# Altium project UZ_A_DAC.PrjPcb (part 1 of 3)
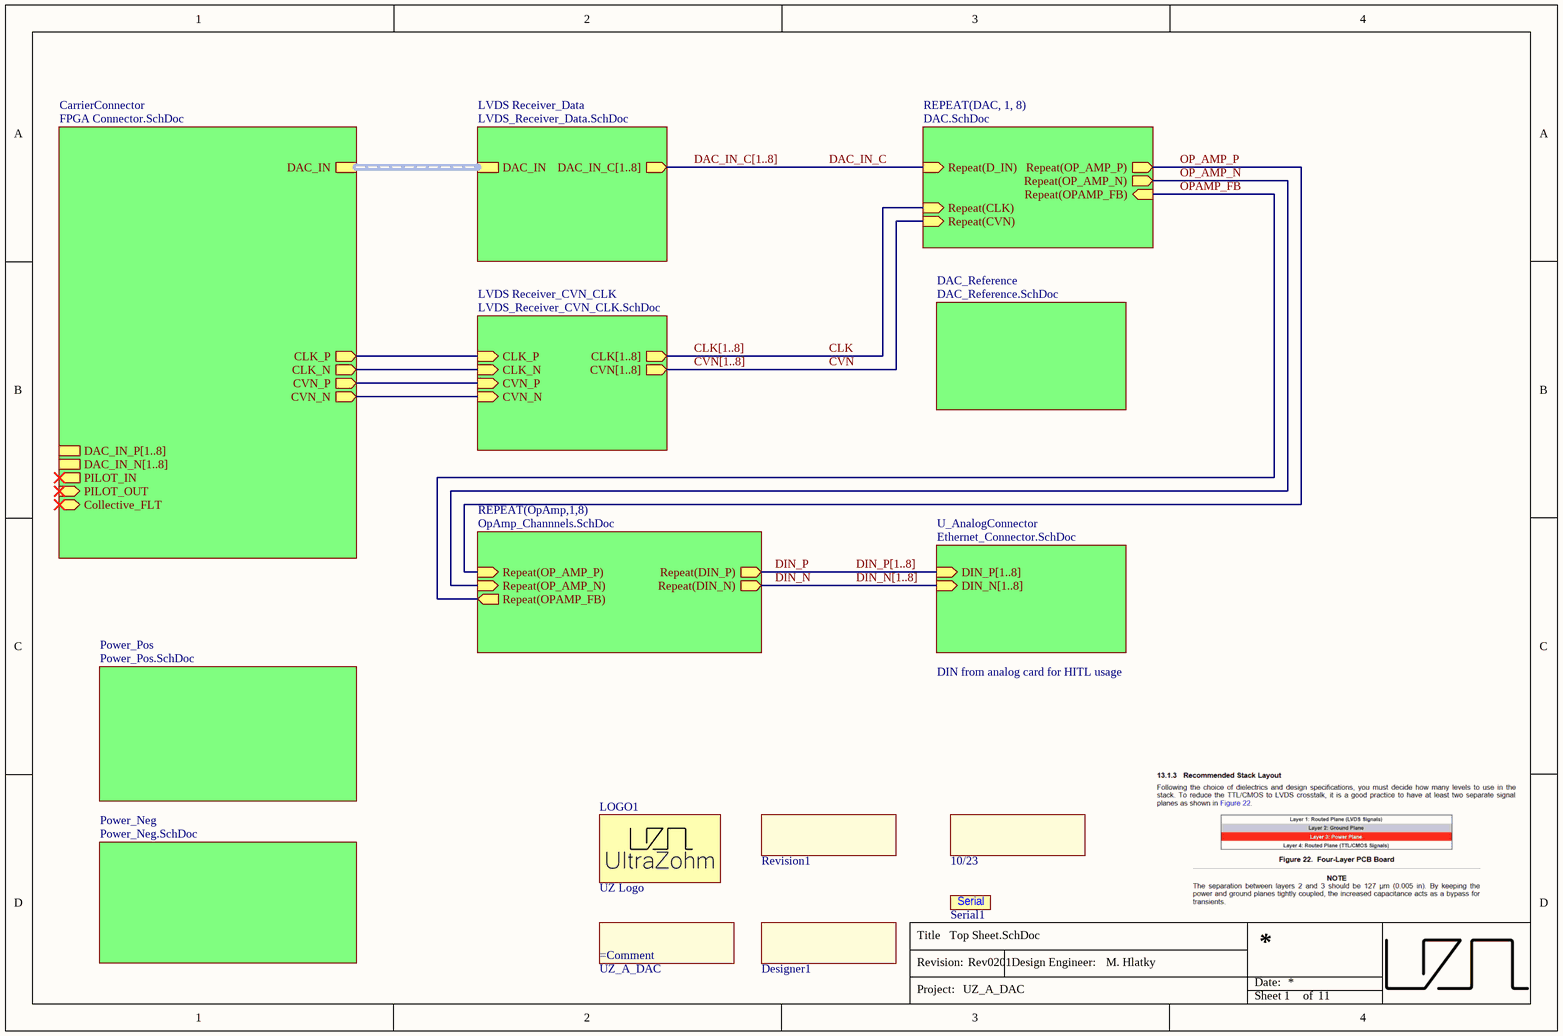
[diagram p0: Top Sheet.SchDoc]
ProjectRevision: Rev0201; ProjectName: UZ_A_DAC; ProjectAuthor: M. Hlatky; AuthorParam: M. Hlatky; Author: M. Hlatky
10 sheets, 409 parts. Net scope: hierarchical (ports join the sheet entries above them; power ports are global).
Board file: UZ_A_DAC.PcbDoc
Sheets:
  Top Sheet.SchDoc
    Power_Pos = Power_Pos.SchDoc
    DAC1 = DAC.SchDoc
    DAC2 = DAC.SchDoc
    DAC3 = DAC.SchDoc
    DAC4 = DAC.SchDoc
    DAC5 = DAC.SchDoc
    DAC6 = DAC.SchDoc
    DAC7 = DAC.SchDoc
    DAC8 = DAC.SchDoc
    OpAmp1 = OpAmp_Channnels.SchDoc
    OpAmp2 = OpAmp_Channnels.SchDoc
    OpAmp3 = OpAmp_Channnels.SchDoc
    OpAmp4 = OpAmp_Channnels.SchDoc
    OpAmp5 = OpAmp_Channnels.SchDoc
    OpAmp6 = OpAmp_Channnels.SchDoc
    OpAmp7 = OpAmp_Channnels.SchDoc
    OpAmp8 = OpAmp_Channnels.SchDoc
    Power_Neg = Power_Neg.SchDoc
    DAC_Reference = DAC_Reference.SchDoc
    U_AnalogConnector = Ethernet_Connector.SchDoc
    CarrierConnector = FPGA Connector.SchDoc
    LVDS Receiver_Data = LVDS_Receiver_Data.SchDoc
    LVDS Receiver_CVN_CLK = LVDS_Receiver_CVN_CLK.SchDoc

## Sheet Top Sheet.SchDoc
size A4; DocumentNumber: 1; SheetNumber: 1; SheetTotal: 11

### Parts
10/23  (no value)  [COMMENT]  (no BOM)
Designer1  (no value)  [Designator:comment]  (no BOM)
LOGO1  UZ Logo  [UZ_Logo_small]  (no BOM)
Revision1  (no value)  [Designator:comment]  (no BOM)
Serial1  Serial #  [SERIAL]  (value not drawn)
UZ_A_DAC  (no value)  [COMMENT]  (no BOM)

### Sub-sheets
CarrierConnector = FPGA Connector.SchDoc: CLK_P (out), CLK_N (out), CVN_P (out), CVN_N (out), PILOT_IN (out), PILOT_OUT (in), Collective_FLT (bidir), DAC_IN, DAC_IN_P[1..8], DAC_IN_N[1..8]
DAC_Reference = DAC_Reference.SchDoc: no entries
LVDS Receiver_CVN_CLK = LVDS_Receiver_CVN_CLK.SchDoc: CLK_P (in), CLK_N (in), CVN_P (in), CVN_N (in), CLK[1..8] (out), CVN[1..8] (out)
LVDS Receiver_Data = LVDS_Receiver_Data.SchDoc: DAC_IN, DAC_IN_C[1..8] (out)
Power_Neg = Power_Neg.SchDoc: no entries
Power_Pos = Power_Pos.SchDoc: no entries
REPEAT(DAC, 1, 8) = DAC.SchDoc: Repeat(CLK) (in), Repeat(D_IN) (in), Repeat(CVN) (in), Repeat(OP_AMP_P) (out), Repeat(OP_AMP_N) (out), Repeat(OPAMP_FB) (in)
REPEAT(OpAmp,1,8) = OpAmp_Channnels.SchDoc: Repeat(DIN_P) (out), Repeat(DIN_N) (out), Repeat(OP_AMP_P) (in), Repeat(OP_AMP_N) (in), Repeat(OPAMP_FB) (out)
U_AnalogConnector = Ethernet_Connector.SchDoc: DIN_P[1..8] (in), DIN_N[1..8] (in)

### Nets
CLK: sheet REPEAT(DAC, 1, 8)/Repeat(CLK)
CLK_N: sheet CarrierConnector/CLK_N, sheet LVDS Receiver_CVN_CLK/CLK_N
CLK_P: sheet CarrierConnector/CLK_P, sheet LVDS Receiver_CVN_CLK/CLK_P
CVN: sheet REPEAT(DAC, 1, 8)/Repeat(CVN)
CVN_N: sheet CarrierConnector/CVN_N, sheet LVDS Receiver_CVN_CLK/CVN_N
CVN_P: sheet CarrierConnector/CVN_P, sheet LVDS Receiver_CVN_CLK/CVN_P
DAC_IN_C: sheet REPEAT(DAC, 1, 8)/Repeat(D_IN)
DIN_N: sheet REPEAT(OpAmp,1,8)/Repeat(DIN_N)
DIN_P: sheet REPEAT(OpAmp,1,8)/Repeat(DIN_P)
OP_AMP_N: sheet REPEAT(DAC, 1, 8)/Repeat(OP_AMP_N), sheet REPEAT(OpAmp,1,8)/Repeat(OP_AMP_N)
OP_AMP_P: sheet REPEAT(DAC, 1, 8)/Repeat(OP_AMP_P), sheet REPEAT(OpAmp,1,8)/Repeat(OP_AMP_P)
OPAMP_FB: sheet REPEAT(DAC, 1, 8)/Repeat(OPAMP_FB), sheet REPEAT(OpAmp,1,8)/Repeat(OPAMP_FB)

### Buses and harness runs
bus CLK[1..8] = sheet LVDS Receiver_CVN_CLK/CLK[1..8]
bus CVN[1..8] = sheet LVDS Receiver_CVN_CLK/CVN[1..8]
bus DAC_IN_C[1..8] = sheet LVDS Receiver_Data/DAC_IN_C[1..8]
bus DIN_N[1..8] = sheet U_AnalogConnector/DIN_N[1..8]
bus DIN_P[1..8] = sheet U_AnalogConnector/DIN_P[1..8]
harness sheet CarrierConnector/DAC_IN = sheet LVDS Receiver_Data/DAC_IN

### Notes on the sheet
- DIN from analog card for HITL usage
- Title
- Revision:
- Design Engineer:
- Date:
- Project:
- Sheet
- of
- (in symbol 6) Serial

### Library data of the parts
10/23 = 5: Create a project parameter named "FinDate" this is the value of this component. It is printed on the PCB. Once the parameter is updated (e.g. new revision) it gets updated on the PCB as well; Manufacturer: PCB Manufacturer; Manufacturer Part Number: Project End Date; Created from: T. Wendt; PartID: 5; Created On: 01.03.2021 09:01:41; Component Type: Date of Project Finalization; Last Updated: 01.03.2021 09:01:41; Type: Standard (No BOM); Value: =FinDate; Live Cycle Status: 1
Designer1 = 4: Create a project parameter named "Author" this is the value of this component. It is printed on the PCB. Once the parameter is updated (e.g. new revision) it gets updated on the PCB as well; Manufacturer: PCB Manufacturer; Manufacturer Part Number: Project Author; Value: M. Hlatky; Created from: T. Wendt; PartID: 4; Created On: 01.03.2021 08:53:41; Component Type: Project Author; Last Updated: 01.03.2021 09:20:27; Type: Standard (No BOM); Live Cycle Status: 1
LOGO1 = Logo small: Manufacturer: UltraZohm; Created from: MGremer; Created: Jan2021_Liegmann; Value: Logo; Manufacturer Part Number: Logo small; PartID: 10; Created On: 03.11.2021 09:04:23; ComponentLink1Description: https://docs.ultrazohm.com/; ComponentLink1URL: homepage; Component Type: Logo; Last Updated: 03.11.2021 09:05:50; Supplier 1: -; Supplier Part Number 1: -; Type: Logo; Live Cycle Status: 1
Revision1 = 3: Create a project parameter named "ProjectRevision" this is the value of this component. It is printed on the PCB. Once the parameter is updated (e.g. new revision) it gets updated on the PCB as well; Manufacturer: PCB Manufacturer; Value: Rev0201; Created from: T. Wendt; PartID: 3; Created On: 01.03.2021 08:50:34; Component Type: Project Revision; Last Updated: 01.03.2021 09:28:36; Manufacturer Part Number: Project Revision; Type: Standard (No BOM); Live Cycle Status: 1
Serial1 = 6: Field to put in a serial number; Manufacturer: PCB Manufacturer; Created from: T. Wendt; PartID: 6; Created On: 02.03.2021 14:31:24; Component Type: Serial Number; Last Updated: 02.03.2021 14:31:24; Manufacturer Part Number: Serial Number; Type: Standard (No BOM); Live Cycle Status: 1
UZ_A_DAC = 2: Create a project parameter named "ProjectNameCustom" this is the value of this component and it is printed on the PCB.; Manufacturer: PCB Manufacturer; Created from: T. Wendt; PartID: 2; Created On: 01.03.2021 08:43:57; Component Type: Project Name; Last Updated: 01.03.2021 09:07:27; Manufacturer Part Number: Project Name; Type: Standard (No BOM); Value: =ProjectNameCustom; Live Cycle Status: 1

## Sheet Power_Pos.SchDoc
size A4; DocumentNumber: 2; SheetNumber: 2; SheetTotal: 11
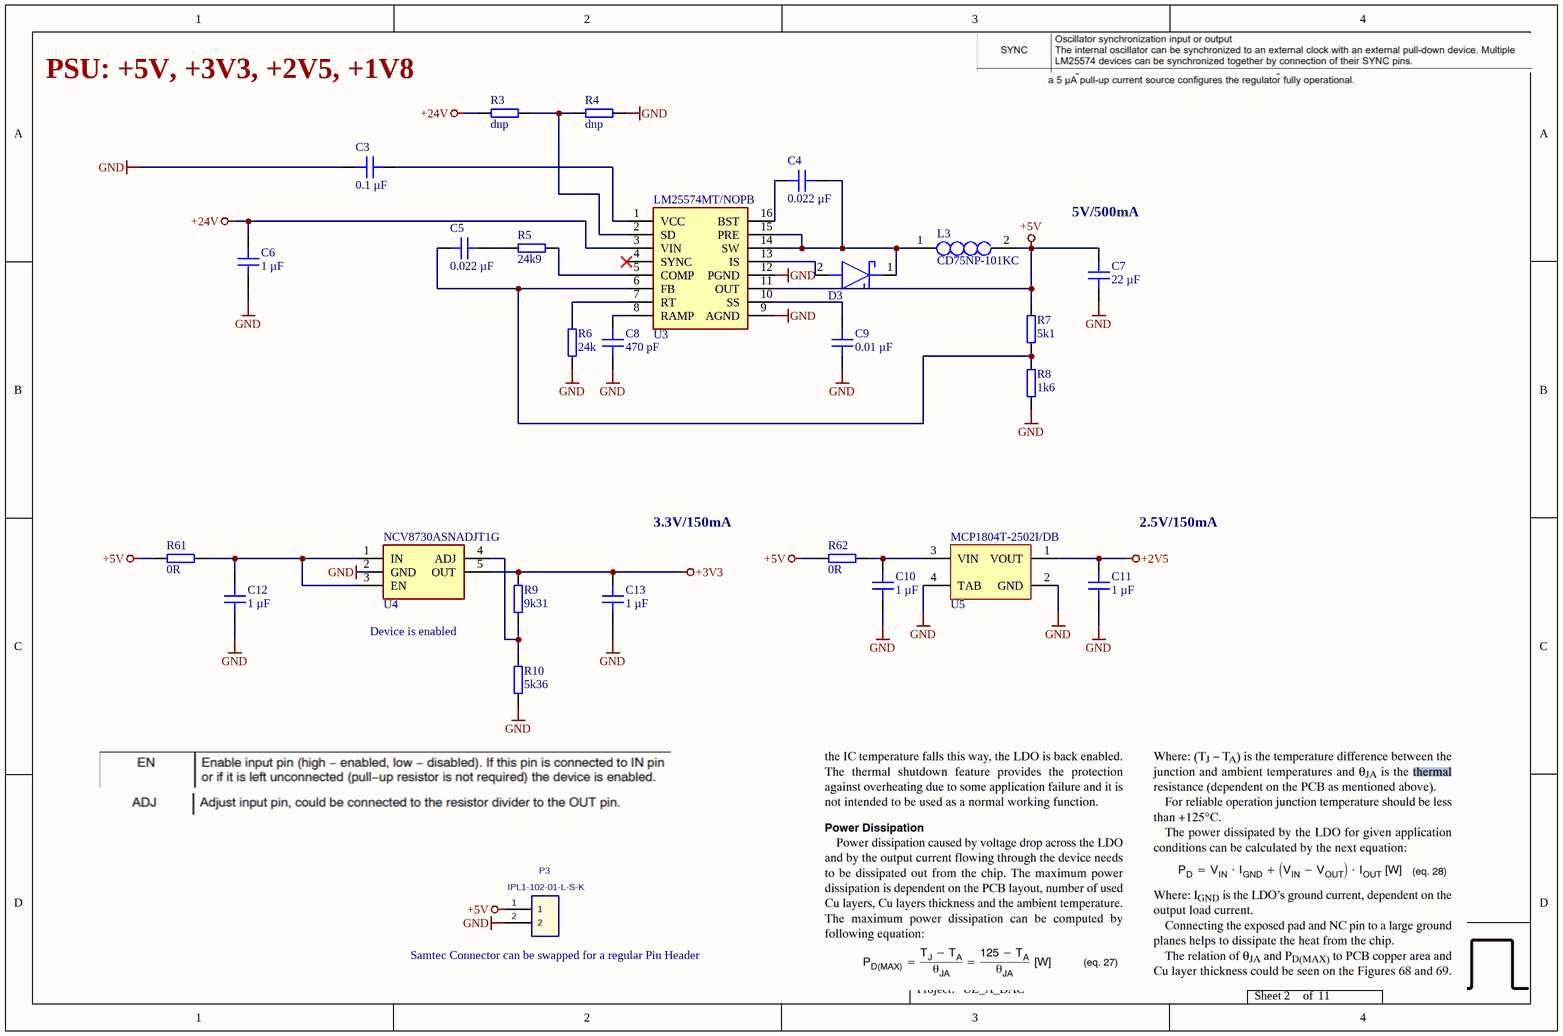
[diagram p1: Power_Pos.SchDoc]

### Parts
C3  0.1 µF  [C_0603]
C4  0.022 µF  [C_0805]
C5  0.022 µF  [C_0805]
C6  1 µF  [C_1206]
C7  22 µF  [C_0805]
C8  470 pF  [C_0805]
C9  0.01 µF  [C_0603]
C10  1 µF  [C_1206]
C11  1 µF  [C_1206]
C12  1 µF  [C_1206]
C13  1 µF  [C_1206]
D3  CDBA260-G  [DIOM5226X262N]  (value not drawn)
L3  CD75NP-101KC  [784787121]
P3  IPL1-102-01-L-S-K  [IPL1-102-01-YYY-S-K]
R3  dnp  [RES 0603_1608]
R4  dnp  [RES 0603_1608]
R5  24k9  [RES 0603_1608]
R6  24k  [RES 0603_1608]
R7  5k1  [RES 0603_1608]
R8  1k6  [RES 0603_1608]
R9  9k31  [RES 0603_1608]
R10  5k36  [RES 0603_1608]
R61  0R  [RES 0603_1608]
R62  0R  [RES 0603_1608]
U3  LM25574MT/NOPB  [SOP65P640X120-16N]
U4  NCV8730ASNADJT1G  [SOT95P275X110-5N]
U5  MCP1804T-2502I/DB  [SOT-223-DB3_N]

### Nets
+2V5: C11.2 U5.1(VOUT)
+3V3: C13.2 R9.2 U4.5(OUT)
+5V: C7.2 L3.2 P3.1 R7.2 R61.1 R62.1 U3.11(OUT)
+24V: C6.2 R3.1 U3.3(VIN)
GND: C3.2 C6.1 C7.1 C8.1 C9.1 C10.1 C11.1 C12.1 C13.1 P3.2 R4.2 R6.1 R8.1 R10.1 U3.9(AGND) U3.12(PGND) U4.2(GND) U5.2(GND) U5.4(TAB)
NetC3_1: C3.1 U3.1(VCC)
NetC4_1: C4.1 U3.16(BST)
NetC4_2: C4.2 D3.1(K) L3.1 U3.14(SW) U3.15(PRE)
NetC5_1: C5.1 R7.1 R8.2 U3.6(FB)
NetC5_2: C5.2 R5.1
NetC8_2: C8.2 U3.8(RAMP)
NetC9_2: C9.2 U3.10(SS)
NetC10_2: C10.2 R62.2 U5.3(VIN)
NetC12_2: C12.2 R61.2 U4.1(IN) U4.3(EN)
NetD3_2: D3.2(A) U3.13(IS)
NetR3_2: R3.2 R4.1 U3.2(SD)
NetR5_2: R5.2 U3.5(COMP)
NetR6_2: R6.2 U3.7(RT)
NetR9_1: R9.1 R10.2 U4.4(ADJ)

Not connected (* = marked no-connect by the designer): U3 4(SYNC)*

### Notes on the sheet
- PSU: +5V, +3V3, +2V5, +1V8
- (near C7) 5V/500mA
- 3.3V/150mA
- 2.5V/150mA
- Device is enabled
- (near P3) Samtec Connector can be swapped for a regular Pin Header
- Title
- Revision:
- Design Engineer:
- Date:
- Project:
- Sheet
- of

### Library data of the parts
C3 = C0603X104K5RAC7411: Capacitor 0603, 50 VDC, 0.1 µF, X7R; Manufacturer: KEMET; Tolerance: 10 %; Voltage Rating: 50 VDC; Created from: MGremer; Manufacturer Part Number: C0603X104K5RAC7411; PartID: 3; Created On: 20.12.2020 13:54:13; ComponentLink1Description: Datasheet; ComponentLink1URL: https://www.mouser.de/datasheet/2/212/1/KEM_C1013_X7R_FT_CAP_SMD-1103280.pdf; Component Type: Capacitor 0603; Device Package: 0603; Last Updated: 04.03.2021 09:24:28; Mounting Type: SMD; Operating Temperature: -55 - 125°C; Series: SMD Comm X7R Flex; Supplier 1: Mouser; Supplier Part Number 1: 80-C0603X104K5R7411; Supplier 2: LCSC; Supplier Part Number 2: C14663; Type: Capacitor; Value: 0.1 µF; Live Cycle Status: 1; LCSC Part Number: C14663; Stock number: Labor SMD Container
C4 C5 = C0805J223K1RACAUTO: Capacitor 0805, 100 VDC, 0.022 µF, X7R; Manufacturer: KEMET; Tolerance: 10 %; Voltage Rating: 100 VDC; Created from: MGremer; Manufacturer Part Number: C0805J223K1RACAUTO; PartID: 42; Created On: 20.12.2020 13:54:13; ComponentLink1Description: Datasheet; ComponentLink1URL: https://www.mouser.de/datasheet/2/212/KEM_C1012_X7R_OPENMODE_SMD-1103265.pdf; Component Type: Capacitor 0805; Device Package: 0805; Last Updated: 04.03.2021 16:12:02; Mounting Type: SMD; Operating Temperature: -55 - 125°C; Series: SMD Auto X7R FO; Supplier 1: Mouser; Supplier Part Number 1: 80-C0805J223K1RCAUTO; Type: Capacitor; Value: 0.022 µF; Live Cycle Status: 1; Stock number: Labor SMD Container
C6 C10-C13 = C1206X105K5RECAUTO: Capacitor 1206, 50 VDC, 1 µF, X7R; Manufacturer: KEMET; Tolerance: 10 %; Voltage Rating: 50 VDC; Created from: MGremer; Manufacturer Part Number: C1206X105K5RECAUTO; PartID: 39; Created On: 20.12.2020 13:54:13; ComponentLink1Description: Datasheet; ComponentLink1URL: https://www.mouser.de/datasheet/2/212/1/KEM_C1090_X7R_ESD-1103328.pdf; Component Type: Capacitor 1206; Device Package: 1206; Last Updated: 20.12.2020 17:44:37; Mounting Type: SMD; Operating Temperature: -55 - 125°C; Series: ESD SMD Auto X7R; Supplier 1: Mouser; Supplier Part Number 1: 80-C1206X105K5REAUTO; Type: Capacitor; Value: 1 µF; Live Cycle Status: 1; Stock number: Labor SMD Container
C7 = GRT21BR61E226ME13L: Capacitor 0805, 25 VDC, 22 µF, X5R; Manufacturer: muRata; Tolerance: 20 %; Voltage Rating: 25 VDC; Created from: MGremer; Manufacturer Part Number: GRT21BR61E226ME13L; PartID: 12; Created On: 20.12.2020 13:54:13; ComponentLink1Description: Datasheet; ComponentLink1URL: https://www.mouser.de/datasheet/2/281/product-794362.pdf; Component Type: Capacitor 0805; Device Package: 0805; Last Updated: 20.12.2020 16:50:55; Mounting Type: SMD; Operating Temperature: -55 - 85°C; Series: GRT; Supplier 1: Mouser; Supplier Part Number 1: 81-GRT21BR61E226ME3L; Type: Capacitor; Value: 22 µF; Live Cycle Status: 1; Stock number: Labor SMD Container
C8 = CC805KRX7R9BB471: Capacitor 0805, 50 VDC, 470 pF, X7R; Manufacturer: FH; Tolerance: 10 %; Voltage Rating: 50	 VDC; Created from: MHlatky; Manufacturer Part Number: CC805KRX7R9BB471; PartID: 91; Created On: 20.12.2020 13:54:13; ComponentLink1Description: Datasheet; ComponentLink1URL: https://www.mouser.de/datasheet/2/447/UPY_GPHC_X7R_6_3V_to_50V_20-1995650.pdf; Component Type: Capacitor 0805; Device Package: 0805; Last Updated: 05.04.2022 16:54:33; Mounting Type: SMD; Operating Temperature: -55 - 125°C; Series: SMD Comm X7R; Supplier 1: Mouser; Supplier Part Number 1: 603-CC805KRX7R9BB471; Type: Capacitor; Value: 470 pF; Live Cycle Status: 1; Stock number: Labor SMD Container
C9 = GCJ188R71H103KA01D: Capacitor 0603, 50 VDC, 0.01 µF, X7R; Manufacturer: muRata; Tolerance: 10 %; Voltage Rating: 50 VDC; Created from: MGremer; Manufacturer Part Number: GCJ188R71H103KA01D; PartID: 1; Created On: 20.12.2020 13:54:13; ComponentLink1Description: Datasheet; ComponentLink1URL: https://www.mouser.de/datasheet/2/281/c03e-516224.pdf; Component Type: Capacitor 0603; Device Package: 0603; Last Updated: 20.12.2020 16:24:16; Mounting Type: SMD; Operating Temperature: -55 - 125°C; Series: GCJ; Supplier 1: Mouser; Supplier Part Number 1: 81-GCJ188R71H103KA1D; Type: Capacitor; Value: 0.01 µF; Live Cycle Status: 1; Stock number: Labor SMD Container
D3 = CDBA260-G: Schottky Diode, 60 V, 2 A; Manufacturer_Name: Central Semiconductor; Manufacturer_Part_Number: CMSH2-60M TR13 PBFREE; Forward Current: 2 A; Forward Voltage: 700mV; Reverse Current: 500 uA; Value: 60V; Created from: MHlatky; Datasheet Link: https://my.centralsemi.com/datasheets/CMSH2-20M_40M_60M_100M.PDF; Height: 2.62mm; Manufacturer Part Number: CDBA260-G; PartID: 9; Created On: 02.02.2021 14:22:37; ComponentLink1Description: Datasheet; ComponentLink1URL: https://www.mouser.de/datasheet/2/80/CDBA240_HF_Thru193240__CDBA2100_HF_RevC-2489669.pdf; Component Type: Schottky Diode; Device Package: SMA (DO-214AC); Last Updated: 22.03.2022 00:32:48; Manufacturer: Central Semiconductor; Mounting Type: SMD; Operating Temperature: -55 - 150 °C; Supplier 1: Mouser; Supplier Part Number 1: 750-CDBA260-G; Type: Schottky Diode; Live Cycle Status: 1; Stock number: not stored
L3 = CD75NP-101KC: SMD Power Inductor, 100uH; Manufacturer_Name: Wurth Elektronik; Manufacturer: Sumida; Type: Festinduktivität; DC current: 720 mA; Value: 430mOhm; Created from: MHlatky; Datasheet Link: https://www.we-online.com/catalog/datasheet/784787121.pdf; Height: 5mm; Manufacturer_Part_Number: 784787121; Manufacturer Part Number: CD75NP-101KC; PartID: 9; Created On: 18.11.2021 09:06:12; ComponentLink1Description: Datasheet; ComponentLink1URL: https://www.mouser.de/datasheet/2/390/CD75-465883.pdf; Component Type: SMD Power Inductor; Device Package: SMD; Last Updated: 05.04.2022 16:55:14; Mounting Type: SMD; Operating Temperature: -40 - 100 °C; Supplier 1: Mouser; Supplier Part Number 1: 851-CD75NP-101KC; Live Cycle Status: 1; Stock number: not stored
P3 = IPL1-102-01-L-S-K: 2.54 mm Single Row Terminal Assembly; Manufacturer: SAMTEC; Created from: MGremer; Number of positions: 2; Manufacturer Part Number: IPL1-102-01-L-S-K; PartID: 3; Created On: 27.11.2020 17:00:15; ComponentLink1Description: Homepage; ComponentLink1URL: https://www.samtec.com/products/ipl1; Component Type: Samtec Connector; Device Package: Connector; Last Updated: 01.04.2021 08:22:46; Mounting Type: THT; Supplier 1: SAMTEC; Supplier Part Number 1: IPL1-102-01-L-S-K; Supplier 2: Digi-Key; Supplier Part Number 2: SAM8824-ND; Type: Connector; Live Cycle Status: 1; Number of rows: 1; Stock number: not stored
R3 R4 = -: SMD resistor E24 series; Created from: MGremer; Manufacturer Part Number: -; PartID: 147; Created On: 14.12.2020 16:17:14; ComponentLink1Description: Datasheet; ComponentLink1URL: -; Component Type: SMD resistor; Device Package: 0603; Last Updated: 02.03.2021 14:07:32; Manufacturer: -; Mounting Type: SMD; Supplier 1: -; Supplier Part Number 1: -; Type: Resistor; Tolerance: -; Value: dnp; Live Cycle Status: 1; Stock number: Labor SMD Container
R5 = CRCW060324K9FKEA: SMD resistor 1%; Manufacturer: Vishay; Created from: MGremer; Manufacturer Part Number: CRCW060324K9FKEA; PartID: 157; Created On: 14.12.2020 16:17:14; ComponentLink1Description: Datasheet; ComponentLink1URL: https://www.mouser.de/datasheet/2/427/dcrcwe3-1762152.pdf; Component Type: SMD resistor; Device Package: 0603; Last Updated: 02.03.2021 14:07:32; Mounting Type: SMD; Supplier 1: Mouser; Supplier Part Number 1: 71-CRCW0603-24.9K-E3; Type: Resistor; Tolerance: 1%; Value: 24k9; Live Cycle Status: 1; Stock number: not stored
R6 = RK73B1JTTD243J: SMD resistor E24 series; Manufacturer: KOA Speer; Tolerance: 5%; Created from: MGremer; Manufacturer Part Number: RK73B1JTTD243J; PartID: 107; Created On: 14.12.2020 16:17:14; ComponentLink1Description: Datasheet; ComponentLink1URL: https://www.mouser.de/datasheet/2/219/RK73B-1825463.pdf; Component Type: SMD resistor; Device Package: 0603; Last Updated: 02.03.2021 14:07:32; Mounting Type: SMD; Supplier 1: Mouser; Supplier Part Number 1: 660-RK73B1JTTD243J; Type: Resistor; Value: 24k; Live Cycle Status: 1; Stock number: Labor SMD Container
R7 = RK73B1JTTDD512J: SMD resistor E24 series; Manufacturer: KOA Speer; Tolerance: 5%; Created from: MGremer; Manufacturer Part Number: RK73B1JTTDD512J; PartID: 91; Created On: 14.12.2020 16:17:14; ComponentLink1Description: Datasheet; ComponentLink1URL: https://www.mouser.de/datasheet/2/219/RK73B-1825463.pdf; Component Type: SMD resistor; Device Package: 0603; Last Updated: 02.03.2021 14:07:32; Mounting Type: SMD; Supplier 1: Mouser; Supplier Part Number 1: 660-RK73B1JTTDD512J; Type: Resistor; Value: 5k1; Live Cycle Status: 1; Stock number: Labor SMD Container
R8 = RK73B1JTTD162J: SMD resistor E24 series; Manufacturer: KOA Speer; Tolerance: 5%; Created from: MGremer; Manufacturer Part Number: RK73B1JTTD162J; PartID: 79; Created On: 14.12.2020 16:17:14; ComponentLink1Description: Datasheet; ComponentLink1URL: https://www.mouser.de/datasheet/2/219/RK73B-1825463.pdf; Component Type: SMD resistor; Device Package: 0603; Last Updated: 02.03.2021 14:07:32; Mounting Type: SMD; Supplier 1: Mouser; Supplier Part Number 1: 660-RK73B1JTTD162J; Type: Resistor; Value: 1k6; Live Cycle Status: 1; Stock number: Labor SMD Container
R9 = ERJ3EKF9311V: SMD resistor 1%; Manufacturer: Panasonic; Created from: MGremer; Manufacturer Part Number: ERJ3EKF9311V; PartID: 171; Created On: 14.12.2020 16:17:14; ComponentLink1Description: Datasheet; ComponentLink1URL: http://industrial.panasonic.com/cdbs/www-data/pdf/RDA0000/AOA0000C304.pdf; Component Type: SMD resistor; Device Package: 0603; Last Updated: 02.03.2021 14:07:32; Mounting Type: SMD; Supplier 1: Farnell; Supplier Part Number 1: 2059405; Type: Resistor; Tolerance: 1%; Value: 9k31; Live Cycle Status: 1; Stock number: not stored
R10 = AC0603FR-075K36L: SMD resistor 1%; Manufacturer: YAGEO; Created from: MGremer; Manufacturer Part Number: AC0603FR-075K36L; PartID: 195; Created On: 14.12.2020 16:17:14; ComponentLink1Description: Datasheet; ComponentLink1URL: https://www.mouser.de/datasheet/2/447/PYu_AC_51_RoHS_L_7-1714230.pdf; Component Type: SMD resistor; Device Package: 0603; Last Updated: 02.07.2021 11:49:34; Mounting Type: SMD; Supplier 1: Mouser; Supplier Part Number 1: 603-AC0603FR-075K36L; Type: Resistor; Tolerance: 1%; Value: 5k36; Live Cycle Status: 1; Stock number: not stored
R61 R62 = RC0603JR-070RL: SMD resistor E24 series; Manufacturer: YAGEO; Tolerance: 5%; Created from: MGremer; Manufacturer Part Number: RC0603JR-070RL; PartID: 1; Created On: 14.12.2020 16:17:14; ComponentLink1Description: Datasheet; ComponentLink1URL: https://www.mouser.de/datasheet/2/447/PYu-RC_Group_51_RoHS_L_10-1664068.pdf; Component Type: SMD resistor; Device Package: 0603; Last Updated: 04.03.2021 09:09:42; Mounting Type: SMD; Supplier 1: Mouser; Supplier Part Number 1: 603-RC0603JR-070RL; Supplier 2: LCSC; Supplier Part Number 2: C21189; Type: Resistor; Value: 0R; Live Cycle Status: 1; Stock number: Labor SMD Container; LCSC Part Number: C21189
U3 = LM25574MT/NOPB: 42-V, 0.5-A Step-Down Switching Regulator; Manufacturer_Name: Texas Instruments; Manufacturer: TI; Created from: MHlatky; Datasheet Link: http://www.ti.com/lit/ds/symlink/lm25574.pdf; Height: 1.2mm; Manufacturer_Part_Number: LM25574MT/NOPB; Manufacturer Part Number: LM25574MT/NOPB; PartID: 3; Created On: 03.03.2022 16:53:36; ComponentLink1Description: Datasheet; ComponentLink1URL: ti.com/general/docs/suppproductinfo.tsp?distId=26&gotoUrl=http%3A%2F%2Fwww.ti.com%2Flit%2Fgpn%2Flm25574; Component Type: LM25574; Last Updated: 08.03.2022 11:31:47; Mounting Type: SOP; Operating Temperature: -40 - 125; Supplier 1: Mouser; Supplier Part Number 1: 926-LM25574MT/NOPB; Type: Step-Down Switching Regulator; Live Cycle Status: 1
U4 = NCV8730ASNADJT1G: LDO Regulator, 150 mA, 38V, 1 A IQ, with PG; Manufacturer_Name: ON Semiconductor; Manufacturer: onsemi; Created from: MHlatky; Datasheet Link: https://www.arrow.com/en/products/ncv8730asnadjt1g/on-semiconductor; Height: 1.1mm; Manufacturer_Part_Number: NCV8730ASNADJT1G; Manufacturer Part Number: NCV8730ASNADJT1G; PartID: 6; Created On: 03.03.2022 16:53:36; ComponentLink1Description: Datasheet; ComponentLink1URL: https://www.mouser.de/datasheet/2/308/1/NCV8730_D-2317675.pdf; Component Type: NCV8730ASNADJT1G; Last Updated: 08.03.2022 11:32:43; Mounting Type: SOT; Operating Temperature: -40 - 125; Supplier 1: Mouser; Supplier Part Number 1: 863-NCV8730ASNADJT1G; Type: Voltage Reference; Live Cycle Status: 1
U5 = MCP1804T-2502I/DB: 150 mA, 28V LDO Regulator With Shutdown; Manufacturer: Microchip Technology; Created from: MHlatky; PackageDescription: 3-Lead Plastic Small Outline Transistor (DB) [SOT-223]; PackageVersion: revBB, Aug-2009; DatasheetVersion: revB, Nov-2009; PackageReference: SOT-223-DB3; Manufacturer Part Number: MCP1804T-2502I/DB; PartID: 12; Created On: 03.03.2022 16:53:36; ComponentLink1Description: Datasheet; ComponentLink1URL: https://www.mouser.de/datasheet/2/268/20002200D-1150037.pdf; Component Type: MCP1804T-2502I/DB; Last Updated: 08.03.2022 18:56:13; Mounting Type: SOT; Operating Temperature: -40 - 85; Supplier 1: Mouser; Supplier Part Number 1: 579-MCP1804T-2502IDB; Type: LDO with Shutdown; Live Cycle Status: 1

## Sheet DAC.SchDoc
size A4; DocumentNumber: 7; SheetNumber: 7; SheetTotal: 11
Used 8 times, as channels DAC1, DAC2, DAC3, DAC4, DAC5, DAC6, DAC7, DAC8. Parts and nets are listed once, with the designators drawn on the sheet.
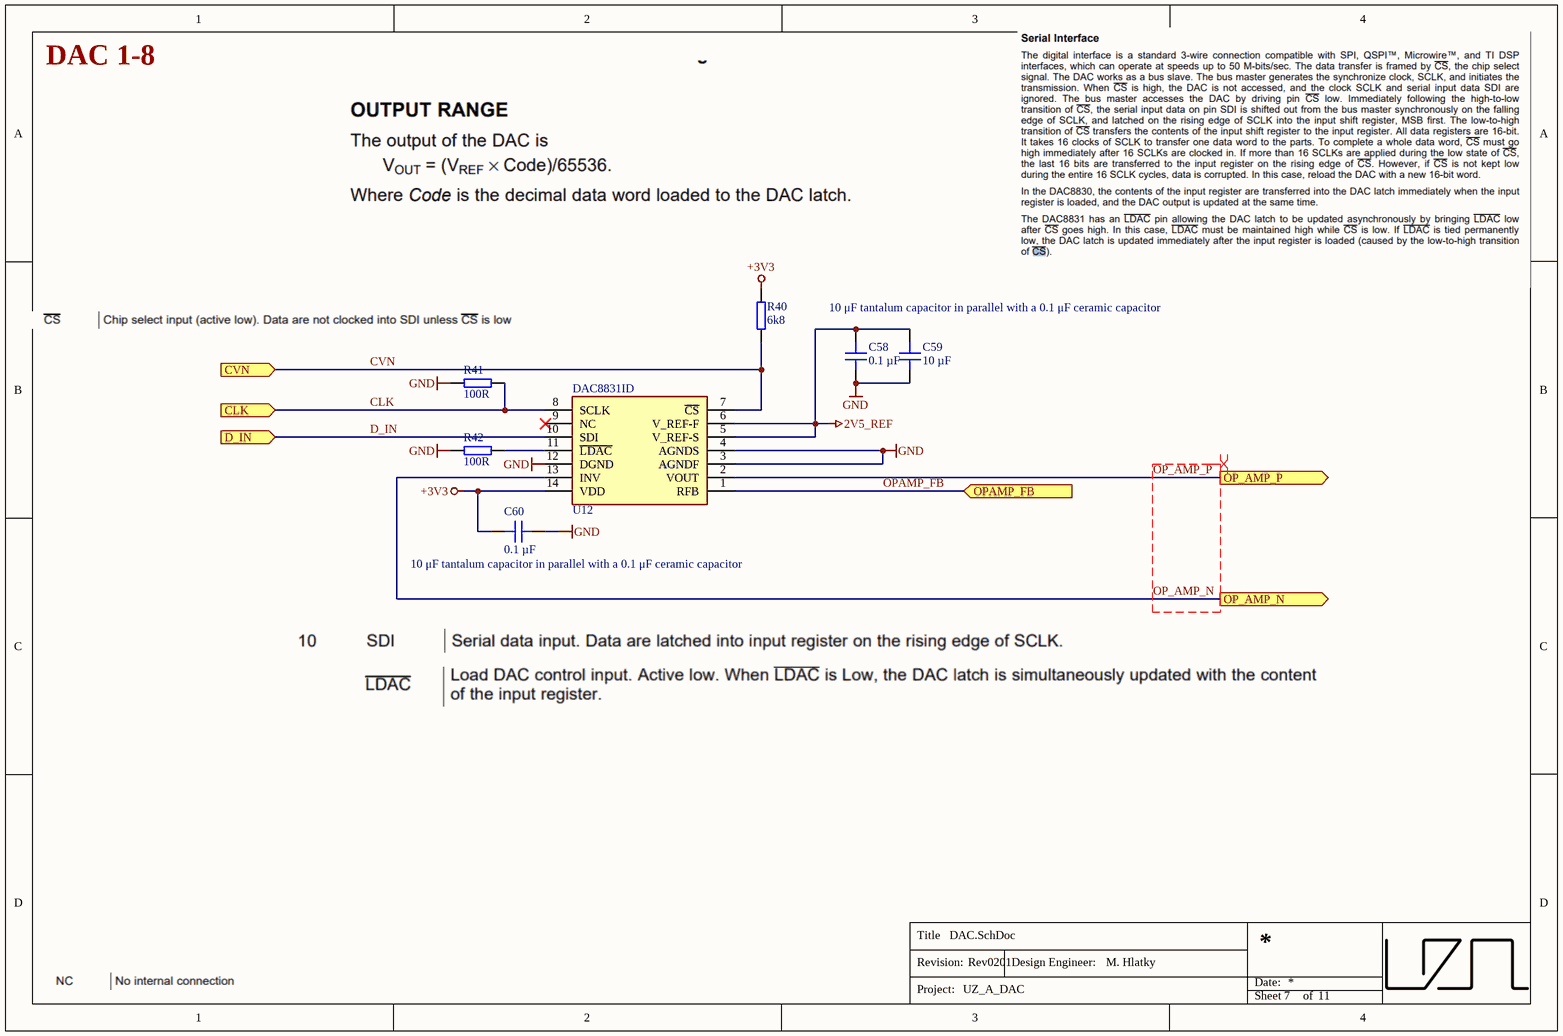
[diagram p2: DAC.SchDoc]

### Parts
C58  0.1 µF  [C_0603]
C59  10 µF  [C_1206]
C60  0.1 µF  [C_0603]
R40  6k8  [RES 0603_1608]
R41  100R  [RES 0603_1608]
R42  100R  [RES 0603_1608]
U12  DAC8831ID  [SOIC127P600X175-14N]

### Ports
CLK (in), CVN (in), D_IN (in), OP_AMP_N (out), OP_AMP_P (out), OPAMP_FB (in)

### Nets
2V5_REF: C58.1 C59.2 U12.5(V_REF-S) U12.6(V_REF-F)
+3V3: C60.2 R40.2 U12.14(VDD)
GND: C58.2 C59.1 C60.1 R41.2 R42.2 U12.3(AGNDF) U12.4(AGNDS) U12.12(DGND)
CLK: R41.1 U12.8(SCLK) ; port CLK
CVN: R40.1 U12.7(~{CS}) ; port CVN
D_IN: U12.10(SDI) ; port D_IN
OP_AMP_N: U12.13(INV) ; port OP_AMP_N
OP_AMP_P: U12.2(VOUT) ; port OP_AMP_P
OPAMP_FB: U12.1(RFB) ; port OPAMP_FB
NetR42_1: R42.1 U12.11(~{LDAC})

Not connected (* = marked no-connect by the designer): U12 9(NC)*

### Channels
DAC1: designators end in A; ports CLK=CLK CVN=CVN D_IN=D_IN OP_AMP_N=OP_AMP_N OP_AMP_P=OP_AMP_P OPAMP_FB=OPAMP_FB
DAC2: designators end in B; ports CLK=CLK CVN=CVN D_IN=D_IN OP_AMP_N=OP_AMP_N OP_AMP_P=OP_AMP_P OPAMP_FB=OPAMP_FB
DAC3: designators end in C; ports CLK=CLK CVN=CVN D_IN=D_IN OP_AMP_N=OP_AMP_N OP_AMP_P=OP_AMP_P OPAMP_FB=OPAMP_FB
DAC4: designators end in D; ports CLK=CLK CVN=CVN D_IN=D_IN OP_AMP_N=OP_AMP_N OP_AMP_P=OP_AMP_P OPAMP_FB=OPAMP_FB
DAC5: designators end in E; ports CLK=CLK CVN=CVN D_IN=D_IN OP_AMP_N=OP_AMP_N OP_AMP_P=OP_AMP_P OPAMP_FB=OPAMP_FB
DAC6: designators end in F; ports CLK=CLK CVN=CVN D_IN=D_IN OP_AMP_N=OP_AMP_N OP_AMP_P=OP_AMP_P OPAMP_FB=OPAMP_FB
DAC7: designators end in G; ports CLK=CLK CVN=CVN D_IN=D_IN OP_AMP_N=OP_AMP_N OP_AMP_P=OP_AMP_P OPAMP_FB=OPAMP_FB
DAC8: designators end in H; ports CLK=CLK CVN=CVN D_IN=D_IN OP_AMP_N=OP_AMP_N OP_AMP_P=OP_AMP_P OPAMP_FB=OPAMP_FB

### Layout directives
differential pair: OP_AMP_N, OP_AMP_P

### Notes on the sheet
- DAC 1-8
- 10 μF tantalum capacitor in parallel with a 0.1 μF ceramic capacitor
- (near C60) 10 μF tantalum capacitor in parallel with a 0.1 μF ceramic capacitor
- Title
- Revision:
- Design Engineer:
- Date:
- Project:
- Sheet
- of

### Library data of the parts
C58 C60 = C0603X104K5RAC7411: as C3 on sheet Power_Pos; Manufacturer Part Number: C0603X104K5RAC7411; PartID: 3; Created On: 20.12.2020 13:54:13; ComponentLink1Description: Datasheet; ComponentLink1URL: https://www.mouser.de/datasheet/2/212/1/KEM_C1013_X7R_FT_CAP_SMD-1103280.pdf; Component Type: Capacitor 0603; Device Package: 0603; Last Updated: 04.03.2021 09:24:28; Mounting Type: SMD; Operating Temperature: -55 - 125°C; Series: SMD Comm X7R Flex; Supplier 1: Mouser; Supplier Part Number 1: 80-C0603X104K5R7411; Supplier 2: LCSC; Supplier Part Number 2: C14663; Type: Capacitor; Value: 0.1 µF; Live Cycle Status: 1; LCSC Part Number: C14663; Stock number: Labor SMD Container
C59 = GRT31CR61H106KE01L: Capacitor 1206, 50 VDC, 10 µF, X5R; Manufacturer: Murata Electronics; Tolerance: 10 %; Voltage Rating: 50 VDC; Created from: MGremer; Manufacturer Part Number: GRT31CR61H106KE01L; PartID: 65; Created On: 20.12.2020 13:54:13; ComponentLink1Description: Datasheet; ComponentLink1URL: https://www.mouser.de/datasheet/2/281/1/GRT31CR61H106KE01_01-1989724.pdf; Component Type: Capacitor 1206; Device Package: 1206; Last Updated: 20.12.2020 16:34:30; Mounting Type: SMD; Operating Temperature: -55 - 85°C; Series: GRT; Supplier 1: Mouser; Supplier Part Number 1: 81-GRT31CR61H106KE1L; Type: Capacitor; Value: 10 µF; Live Cycle Status: 1; Stock number: Labor SMD Container
R40 = RK73B1JTTDD682J: SMD resistor E24 series; Manufacturer: KOA Speer; Tolerance: 5%; Created from: MGremer; Manufacturer Part Number: RK73B1JTTDD682J; PartID: 94; Created On: 14.12.2020 16:17:14; ComponentLink1Description: Datasheet; ComponentLink1URL: https://www.mouser.de/datasheet/2/219/RK73B-1825463.pdf; Component Type: SMD resistor; Device Package: 0603; Last Updated: 02.03.2021 14:07:32; Mounting Type: SMD; Supplier 1: Mouser; Supplier Part Number 1: 660-RK73B1JTTDD682J; Type: Resistor; Value: 6k8; Live Cycle Status: 1; Stock number: Labor SMD Container
R41 R42 = AC0603FR-13100RL: SMD resistor 1%; Manufacturer: Yageo; Created from: MGremer; Manufacturer Part Number: AC0603FR-13100RL; PartID: 161; Created On: 14.12.2020 16:17:14; ComponentLink1Description: Datasheet; ComponentLink1URL: https://www.mouser.de/datasheet/2/447/PYu-AC_51_RoHS_L_7-1714230.pdf; Component Type: SMD resistor; Device Package: 0603; Last Updated: 02.03.2021 14:07:32; Mounting Type: SMD; Supplier 1: Mouser; Supplier Part Number 1: 603-AC0603FR-13100RL; Type: Resistor; Tolerance: 1%; Value: 100R; Live Cycle Status: 1; Stock number: not stored
U12 = DAC8831ID: 16-Bit, Ultra-Low Power, Voltage-OutputcDigital-to-Analog Converters; Manufacturer_Name: Texas Instruments; Manufacturer: TI; Channels: 1; Sampling Rate: 2 MS/s; Interface Type: 3-Wire, DSP, Microwire, QSPI, SPI; Architecture: R-2R; Supply Voltage: 2.7 V to 5.5 V; Created from: MHlatky; Datasheet Link: http://www.ti.com/lit/gpn/dac8831; Height: 1.75mm; Manufacturer_Part_Number: DAC8831ID; Manufacturer Part Number: DAC8831ID; PartID: 2; Created On: 03.03.2022 16:53:36; ComponentLink1Description: Datasheet; ComponentLink1URL: https://www.ti.com/lit/ds/slas449d/slas449d.pdf?ts=1646313854062&ref_url=https%253A%252F%252Fwww.google.com%252F; Component Type: DAC8831; Last Updated: 08.03.2022 10:45:20; Mounting Type: SOIC; Operating Temperature: -40 - 85; Supplier 1: Mouser; Supplier Part Number 1: 595-DAC8831ID; Type: DAC; Resolution: 16-Bit; Live Cycle Status: 1

## Sheet OpAmp_Channnels.SchDoc
size A4; DocumentNumber: 9; SheetNumber: 9; SheetTotal: 11
Used 8 times, as channels OpAmp1, OpAmp2, OpAmp3, OpAmp4, OpAmp5, OpAmp6, OpAmp7, OpAmp8. Parts and nets are listed once, with the designators drawn on the sheet.
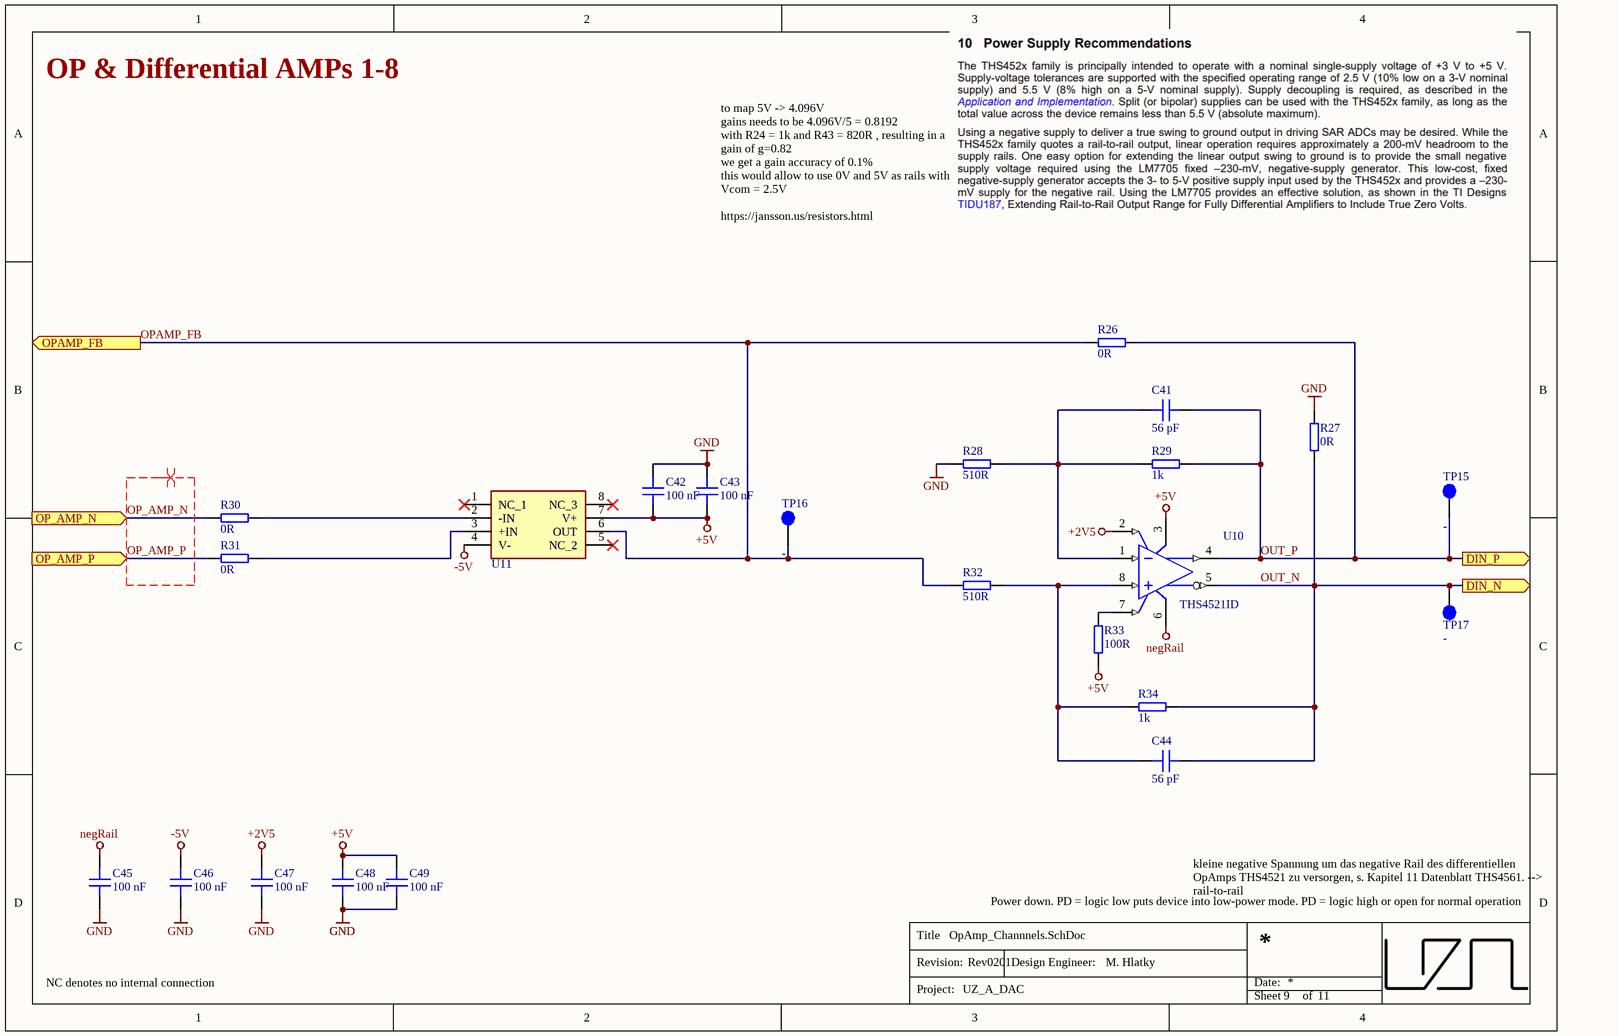
[diagram p3: OpAmp_Channnels.SchDoc]

### Parts
C41  56 pF  [C_0603]
C42  100 nF  [C_0603]
C43  100 nF  [C_0603]
C44  56 pF  [C_0603]
C45  100 nF  [C_0603]
C46  100 nF  [C_0603]
C47  100 nF  [C_0603]
C48  100 nF  [C_0603]
C49  100 nF  [C_0603]
R26  0R  [RES 0603_1608]
R27  0R  [RES 0603_1608]
R28  510R  [RES 0603_1608]
R29  1k  [RES 0603_1608]
R30  0R  [RES 0603_1608]
R31  0R  [RES 0603_1608]
R32  510R  [RES 0603_1608]
R33  100R  [RES 0603_1608]
R34  1k  [RES 0603_1608]
TP15  -  [TP_1mm]
TP16  -  [TP_1mm]
TP17  -  [TP_1mm]
U10  THS4521ID  [D0008A_M]
U11  OPA727AIDGKT  [SOP65P490X110-8N]  (value not drawn)

### Ports
DIN_N (out), DIN_P (out), OP_AMP_N (in), OP_AMP_P (in), OPAMP_FB (out)

### Nets
+2V5: C47.2 U10.2(VOCM)
+5V: C42.1 C43.1 C48.2 C49.2 R33.2 U10.3(VS+) U11.7(V+)
-5V: C46.2 U11.4(V-)
GND: C42.2 C43.2 C45.1 C46.1 C47.1 C48.1 C49.1 R27.2 R28.1
negRail: C45.2 U10.6(VS-)
OP_AMP_N: R30.1 ; port OP_AMP_N
OP_AMP_P: R31.1 ; port OP_AMP_P
OPAMP_FB: R26.1 R32.1 TP16.1 U11.6(OUT) ; port OPAMP_FB
OUT_N: C44.2 R27.1 R34.2 TP17.1 U10.5(VOUT-) ; port DIN_N
OUT_P: C41.2 R26.2 R29.2 TP15.1 U10.4(VOUT+) ; port DIN_P
NetC41_1: C41.1 R28.2 R29.1 U10.1(VIN-)
NetC44_1: C44.1 R32.2 R34.1 U10.8(VIN+)
NetR30_2: R30.2 U11.2(-IN)
NetR31_2: R31.2 U11.3(+IN)
NetR33_1: R33.1 U10.7(~{PD})

Not connected (* = marked no-connect by the designer): U11 1(NC_1)* 5(NC_2)* 8(NC_3)*

### Channels
OpAmp1: designators end in A; ports DIN_N=DIN_N1 DIN_P=DIN_P1 OP_AMP_N=OP_AMP_N OP_AMP_P=OP_AMP_P OPAMP_FB=OPAMP_FB
OpAmp2: designators end in B; ports DIN_N=DIN_N2 DIN_P=DIN_P2 OP_AMP_N=OP_AMP_N OP_AMP_P=OP_AMP_P OPAMP_FB=OPAMP_FB
OpAmp3: designators end in C; ports DIN_N=DIN_N3 DIN_P=DIN_P3 OP_AMP_N=OP_AMP_N OP_AMP_P=OP_AMP_P OPAMP_FB=OPAMP_FB
OpAmp4: designators end in D; ports DIN_N=DIN_N4 DIN_P=DIN_P4 OP_AMP_N=OP_AMP_N OP_AMP_P=OP_AMP_P OPAMP_FB=OPAMP_FB
OpAmp5: designators end in E; ports DIN_N=DIN_N5 DIN_P=DIN_P5 OP_AMP_N=OP_AMP_N OP_AMP_P=OP_AMP_P OPAMP_FB=OPAMP_FB
OpAmp6: designators end in F; ports DIN_N=DIN_N6 DIN_P=DIN_P6 OP_AMP_N=OP_AMP_N OP_AMP_P=OP_AMP_P OPAMP_FB=OPAMP_FB
OpAmp7: designators end in G; ports DIN_N=DIN_N7 DIN_P=DIN_P7 OP_AMP_N=OP_AMP_N OP_AMP_P=OP_AMP_P OPAMP_FB=OPAMP_FB
OpAmp8: designators end in H; ports DIN_N=DIN_N8 DIN_P=DIN_P8 OP_AMP_N=OP_AMP_N OP_AMP_P=OP_AMP_P OPAMP_FB=OPAMP_FB

### Layout directives
differential pair: OP_AMP_N, OP_AMP_P

### Notes on the sheet
- OP & Differential AMPs 1-8
- to map 5V -> 4.096V
  gains needs to be 4.096V/5 = 0.8192
  with R24 = 1k and R43 = 820R , resulting in a gain of g=0.82
  we get a gain accuracy of 0.1%
  this would allow to use 0V and 5V as rails with Vcom = 2.5V
  https://jansson.us/resistors.html
- Power down. PD = logic low puts device into low-power mode. PD = logic high or open for normal operation
- kleine negative Spannung um das negative Rail des differentiellen OpAmps THS4521 zu versorgen, s. Kapitel 11 Datenblatt THS4561. --> rail-to-rail
- NC denotes no internal connection
- Title
- Revision:
- Design Engineer:
- Date:
- Project:
- Sheet
- of

### Library data of the parts
C41 C44 = VJ0603A560JXACW1BC: Capacitor 0603, 50 VDC, 56 pF, C0G; Manufacturer: Vishay; Tolerance: 5 %; Voltage Rating: 50 VDC; Created from: MGremer; Manufacturer Part Number: VJ0603A560JXACW1BC; PartID: 45; Created On: 20.12.2020 13:54:13; ComponentLink1Description: Datasheet; ComponentLink1URL: https://www.mouser.de/datasheet/2/427/vjw1bcbascomseries-1762447.pdf; Component Type: Capacitor 0603; Device Package: 0603; Last Updated: 20.12.2020 16:24:16; Mounting Type: SMD; Operating Temperature: -55 - 125°C; Series: VJ W1BC Basic Comm; Supplier 1: Mouser; Supplier Part Number 1: 77-VJ0603A560JXACBC; Type: Capacitor; Value: 56 pF; Live Cycle Status: 1; Stock number: not stored
C42 C43 C45-C49 = C0603C104K9PACTU: Capacitor 0603, 6.3 VDC, 100 nF, X5R; Manufacturer: KEMET; Tolerance: 10 %; Voltage Rating: 6.3 VDC; Created from: MGremer; Manufacturer Part Number: C0603C104K9PACTU; PartID: 70; Created On: 20.12.2020 13:54:13; ComponentLink1Description: Datasheet; ComponentLink1URL: https://www.mouser.de/datasheet/2/212/KEM_C1006_X5R_SMD-1103249.pdf; Component Type: Capacitor 0603; Device Package: 0603; Last Updated: 20.01.2021 13:57:36; Mounting Type: SMD; Operating Temperature: -55 - 85°C; Series: SMD Comm X5R; Supplier 1: Mouser; Supplier Part Number 1: 80-C0603C104K9P; Type: Capacitor; Value: 100 nF; Live Cycle Status: 1; Stock number: not stored
R26 R27 R30 R31 = RC0603JR-070RL: as R61 on sheet Power_Pos; Manufacturer Part Number: RC0603JR-070RL; PartID: 1; Created On: 14.12.2020 16:17:14; ComponentLink1Description: Datasheet; ComponentLink1URL: https://www.mouser.de/datasheet/2/447/PYu-RC_Group_51_RoHS_L_10-1664068.pdf; Component Type: SMD resistor; Device Package: 0603; Last Updated: 04.03.2021 09:09:42; Mounting Type: SMD; Supplier 1: Mouser; Supplier Part Number 1: 603-RC0603JR-070RL; Supplier 2: LCSC; Supplier Part Number 2: C21189; Type: Resistor; Value: 0R; Live Cycle Status: 1; Stock number: Labor SMD Container; LCSC Part Number: C21189
R28 R32 = RK73B1JTTD511J: SMD resistor E24 series; Manufacturer: KOA Speer; Tolerance: 5%; Created from: MGremer; Manufacturer Part Number: RK73B1JTTD511J; PartID: 67; Created On: 14.12.2020 16:17:14; ComponentLink1Description: Datasheet; ComponentLink1URL: https://www.mouser.de/datasheet/2/219/RK73B-1825463.pdf; Component Type: SMD resistor; Device Package: 0603; Last Updated: 02.03.2021 14:07:32; Mounting Type: SMD; Supplier 1: Mouser; Supplier Part Number 1: 660-RK73B1JTTD511J; Type: Resistor; Value: 510R; Live Cycle Status: 1; Stock number: Labor SMD Container
R29 R34 = RK73B1JTTDD102J: SMD resistor E24 series; Manufacturer: KOA Speer; Tolerance: 5%; Created from: MGremer; Manufacturer Part Number: RK73B1JTTDD102J; PartID: 74; Created On: 14.12.2020 16:17:14; ComponentLink1Description: Datasheet; ComponentLink1URL: https://www.mouser.de/datasheet/2/219/RK73B-1825463.pdf; Component Type: SMD resistor; Device Package: 0603; Last Updated: 02.03.2021 14:07:32; Mounting Type: SMD; Supplier 1: Mouser; Supplier Part Number 1: 660-RK73B1JTTDD102J; Type: Resistor; Value: 1k; Live Cycle Status: 1; Stock number: Labor SMD Container
R33 = AC0603FR-13100RL: as R41 on sheet DAC; Manufacturer Part Number: AC0603FR-13100RL; PartID: 161; Created On: 14.12.2020 16:17:14; ComponentLink1Description: Datasheet; ComponentLink1URL: https://www.mouser.de/datasheet/2/447/PYu-AC_51_RoHS_L_7-1714230.pdf; Component Type: SMD resistor; Device Package: 0603; Last Updated: 02.03.2021 14:07:32; Mounting Type: SMD; Supplier 1: Mouser; Supplier Part Number 1: 603-AC0603FR-13100RL; Type: Resistor; Tolerance: 1%; Value: 100R; Live Cycle Status: 1; Stock number: not stored
TP15-TP17 = -: Test Point 1 mm; Value: TP; Created from: MGremer; Created: 2018_06_25_AGeiger; Manufacturer Part Number: -; PartID: 9; Created On: 02.03.2021 14:59:37; ComponentLink1Description: Datasheet; ComponentLink1URL: -; ComponentLink2Description: Homepage; ComponentLink2URL: -; Component Type: Test Point; Device Package: SMD; Last Updated: 03.11.2021 09:04:23; Manufacturer: -; Minimum Order: 1; Mounting Type: SMD; Supplier 1: -; Supplier Part Number 1: -; Type: Test point; Live Cycle Status: 1; Stock number: not stored
U10 = THS4521ID: Very Low Power, Negative Rail Input, Rail-To-Rail Output, Fully Differential Amplifier; Manufacturer: TI; Io(Typ)(mA): 55; Vs(Max)(V): 5.5; Eco-Plan: Green (RoHS & no Sb/Br); Iq per channel(Max)(mA): 1.25; Vn at Flatband(Typ)(nV/rtHz): 4.6; 2nd Harmonic(dBc): 133; Number of Channels: 1; Rail-Rail: Out; @ MHz: 0.01; Slew Rate(Typ)(V/us): 490; BW @ Acl(MHz): 145; Vs(Min)(V): 2.5; Vio(Max)(mV): 2; 3rd Harmonic(dBc): 140; Created from: MHlatky; ComponentLink2Description: Datasheet; Mounting Technology: Surface Mount; PackageReference: D0008A; ComponentLink1Description: Datasheet; SubFamily: Fully Differential Amplifier; DatasheetVersion: SBOS458F; Code_JEDEC: MS-012; ComponentLink3URL: http://www.ti.com/litv/pdf/msoi002j; PartNumber: THS4521ID; PackageDescription: 8-Pin Plastic Small Outline, Body 4.9 x 3.9 mm, Pitch 1.27 mm; ComponentLink1URL: https://www.ti.com/lit/ds/symlink/ths4521.pdf?HQS=dis-mous-null-mousermode-dsf-pf-null-wwe&ts=1646514637932&ref_url=https%253A%252F%252Fwww.mouser.de%252F; ComponentLink2URL: http://www.ti.com/general/docs/lit/getliterature.tsp?genericPartNumber=THS4521&fileType=pdf; ComponentLink3Description: Package Specification; PackageVersion: 4040047-3/M, 06/2011; Manufacturer Part Number: THS4521ID; PartID: 10; Created On: 03.03.2022 16:53:36; Component Type: THS4521ID; Last Updated: 08.03.2022 12:27:24; Mounting Type: SOIC; Operating Temperature: -40 - 85; Supplier 1: Mouser; Supplier Part Number 1: 595-THS4521ID; Type: Differential Amplifier; Live Cycle Status: 1
U11 = OPA727AIDGKT: e-trim™ 20MHz, High Precision CMOS Operational Amplifier; Manufacturer_Name: Texas Instruments; Manufacturer: TI; Created from: MHlatky; Datasheet Link: http://www.ti.com/lit/ds/symlink/opa727.pdf; Height: 1.1mm; Manufacturer_Part_Number: OPA727AIDGKT; Manufacturer Part Number: OPA727AIDGKT; PartID: 7; Created On: 03.03.2022 16:53:36; ComponentLink1Description: Datasheet; ComponentLink1URL: https://www.ti.com/lit/ds/symlink/opa727.pdf?HQS=dis-mous-null-mousermode-dsf-pf-null-wwe&ts=1646513691709&ref_url=https%253A%252F%252Fwww.mouser.de%252F; Component Type: OPA727AIDGKT; Last Updated: 03.03.2022 16:54:19; Mounting Type: SOP; Operating Temperature: -40 - 125; Supplier 1: Mouser; Supplier Part Number 1: 595-OPA727AIDGKT; Type: OpAmp; Live Cycle Status: 1